# Altium schematic sheet Sheet1.SchDoc
size 420 x 297 mm; SheetNumber: 1; SheetTotal: 1
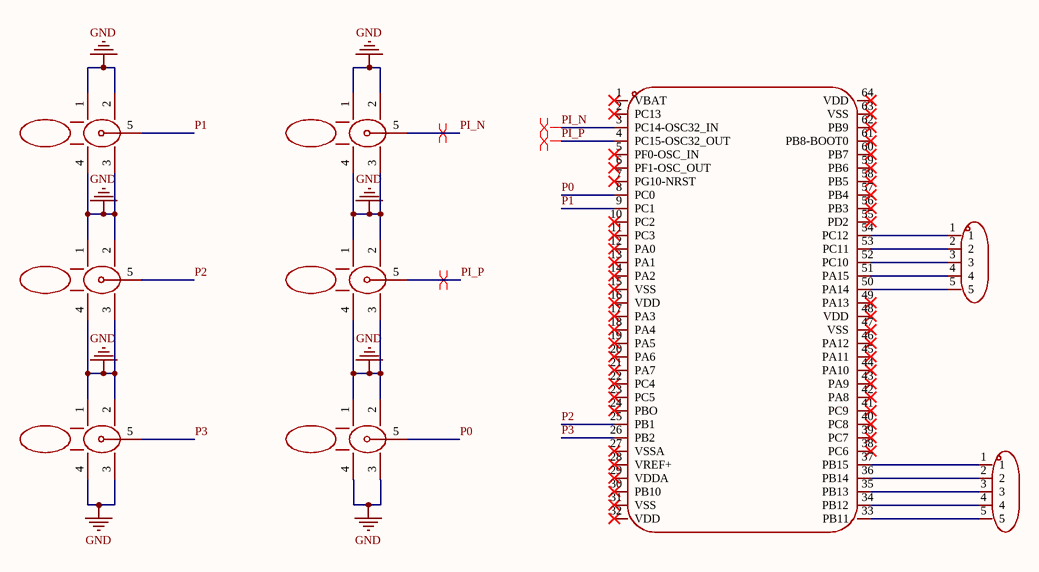
[diagram p0: Sheet1.SchDoc]

## Parts
H1  PZ200V-11-05P  [HDR-TH_5P-P2.00-V-M]  (value not drawn)
H2  PZ200V-11-05P  [HDR-TH_5P-P2.00-V-M]  (value not drawn)
RF1  BWSMA-KE-Z001  [SMA-TH_BWSMA-KE-Z001]  (value not drawn)
RF2  BWSMA-KE-Z001  [SMA-TH_BWSMA-KE-Z001]  (value not drawn)
RF3  BWSMA-KE-Z001  [SMA-TH_BWSMA-KE-Z001]  (value not drawn)
RF4  BWSMA-KE-Z001  [SMA-TH_BWSMA-KE-Z001]  (value not drawn)
RF5  BWSMA-KE-Z001  [SMA-TH_BWSMA-KE-Z001]  (value not drawn)
RF6  BWSMA-KE-Z001  [SMA-TH_BWSMA-KE-Z001]  (value not drawn)
U1  STM32G474RBT3  [LQFP-64_L10.0-W10.0-P0.50-LS12.0-BL]  (value not drawn)

## Nets
GND: RF1.1 RF1.2 RF1.3 RF1.4 RF2.1 RF2.2 RF2.3 RF2.4 RF3.1 RF3.2 RF3.3 RF3.4 RF4.1 RF4.2 RF4.3 RF4.4 RF5.1 RF5.2 RF5.3 RF5.4 RF6.1 RF6.2 RF6.3 RF6.4
P0: RF6.5 U1.8(PC0)
P1: RF1.5 U1.9(PC1)
P2: RF3.5 U1.25(PB1)
P3: RF5.5 U1.26(PB2)
PI_N: RF2.5 U1.3(PC14-OSC32_IN)
PI_P: RF4.5 U1.4(PC15-OSC32_OUT)
NetH1_1: H1.1 U1.54(PC12)
NetH1_2: H1.2 U1.53(PC11)
NetH1_3: H1.3 U1.52(PC10)
NetH1_4: H1.4 U1.51(PA15)
NetH1_5: H1.5 U1.50(PA14)
NetH2_1: H2.1 U1.37(PB15)
NetH2_2: H2.2 U1.36(PB14)
NetH2_3: H2.3 U1.35(PB13)
NetH2_4: H2.4 U1.34(PB12)
NetH2_5: H2.5 U1.33(PB11)

Not connected (* = marked no-connect by the designer): U1 1(VBAT)* 2(PC13)* 5(PF0-OSC_IN)* 6(PF1-OSC_OUT)* 7(PG10-NRST)* 10(PC2)* 11(PC3)* 12(PA0)* 13(PA1)* 14(PA2)* 15(VSS)* 16(VDD)* 17(PA3)* 18(PA4)* 19(PA5)* 20(PA6)* 21(PA7)* 22(PC4)* 23(PC5)* 24(PBO)* 27(VSSA)* 28(VREF+)* 29(VDDA)* 30(PB10)* 31(VSS)* 32(VDD)* 38(PC6)* 39(PC7)* 40(PC8)* 41(PC9)* 42(PA8)* 43(PA9)* 44(PA10)* 45(PA11)* 46(PA12)* 47(VSS)* 48(VDD)* 49(PA13)* 55(PD2)* 56(PB3)* 57(PB4)* 58(PB5)* 59(PB6)* 60(PB7)* 61(PB8-BOOT0)* 62(PB9)* 63(VSS)* 64(VDD)*

## Layout directives
differential pair: PI_N, PI_P

## Notes on the sheet
- THIS DOCUMENT AND THE DATA DISCLOSED HEREIN OR
- HEREWITH IS THE PROPERTY OF ALTIUM LIMITED AND MAY
- DWG NO:
- REVISION
- REV:
- DESCRIPTION
- DATE
- APPROVED
- BE FREELY DISTRIBUTED IN WHOLE. NO RIGHTS ARE
- RESERVED OR EXPRESS OR IMPLIED WARANTEE GIVEN.
- ENG:
- APPROVALS
- PROJECT
- DSN:
- CHK:
- REFERENCE DOCUMENTS
- PROJECT REVISION:
- TITLE
- DOCUMENT REVISION:
- DESIGN ITEM:
- BOM:
- FAB DWG:
- PCB DWG:
- ASSY DWG:
- SCALE:
- A3
- SIZE
- CAGE CODE
- FILE NAME
- DWG NO.
- SHEET
- OF
- REV

## Library data of the parts
H1 H2 = PZ200V-11-05P: Manufacturer: XFCN(兴飞); Add into BOM: yes; Pin Structure: 1x5P; Pitch: 2mm; Circluar Pins/Square Pins: Square Pins; Symbol: PZ200V-11-05P; Device: PZ200V-11-05P; LCSC Part Name: 间距:2mm 1x5P 直插 方针; Supplier Part: C541859; Manufacturer Part: PZ200V-11-05P; Supplier Footprint: 插件,P=2mm; JLCPCB Part Class: Extended Part; Datasheet: https://atta.szlcsc.com/upload/public/pdf/source/20200518/C541858_7610F54454E936EFCDE06B655DF7C837.pdf; Supplier: LCSC; Convert to PCB: yes; Row Spacing: -; Mounting Type: Straight; Number of Rows: Plugin; Number of Pins: 5P; Current Rating (Max): -; Voltage Rating (Max): -; Length of Mating Pin: 3.9mm; Insulation Height: 2mm; Length of End Connection Pin: 2.8mm; Contact Plating: -; Operating Temperature Range: -40℃~+105℃; Soldering Temperature(Max): -; Color: Black
RF1-RF6 = BWSMA-KE-Z001_C496549: Manufacturer: BAT WIRELESS(蝙蝠无线); Add into BOM: yes; Connector Type: 板端; Interface Type: 内孔; Number of Ports: 1; RF Series: SMA; Impedance: 50Ω; Style: 正脚; Symbol: BWSMA-KE-Z001; Device: BWSMA-KE-Z001_C496549; LCSC Part Name: 内孔 SMA 正脚; Supplier Part: C496549; Manufacturer Part: BWSMA-KE-Z001; Supplier Footprint: 插件; JLCPCB Part Class: Extended Part; Datasheet: https://atta.szlcsc.com/upload/public/pdf/source/20221228/40BF41E56A06003A0210E1785CA66EA6.pdf; Supplier: LCSC; Convert to PCB: yes; Interface Diameter: -; Interface Length/Height: -; Frequency-Max: -; Contact Material: -; Contact Plating: -; Operating Temperature Range: -65℃~+165℃; Soldering Temperature(Max): -
U1 = STM32G474RBT3: Manufacturer: ST(意法半导体); Add into BOM: yes; CPU Core: ARM-MSeries; CPU Maximum Speed: 170MHz; Program Storage Size: 128KB; Program Memory Type: FLASH; GPIO Ports Number: 52; ADC (Bit): 12bit; Low Voltage Detection Threshold: 1.71V~3.6V; Symbol: STM32G474RBT3; Device: STM32G474RBT3; LCSC Part Name: 带DSP和FPU的170MHz主流ARM Cortex-M4 MCU，具有128 KB Flash存储器、数学加速器、高分辨率定时器和高模拟电平集成; Supplier Part: C1235414; Manufacturer Part: STM32G474RBT3; Supplier Footprint: LQFP-64(10x10); JLCPCB Part Class: Extended Part; Datasheet: https://atta.szlcsc.com/upload/public/pdf/source/20210601/070C5CED5EB45737871E6667B39F1293.pdf; Supplier: LCSC; Convert to PCB: yes; DAC (Bit): 12bit; Application Area: -